# Altium schematic sheet Thermokoppel.SchDoc: Soldeerstation
size A4; SheetNumber: 4; SheetTotal: 5; SPICEModelCacheXJIMZCRK: <root> / <DocumentId>XJIMZCRK</DocumentId> / <CacheFrame Number="0"> / <Model Name="pnp" Kind="MDL"> / <Text>*Default PNP BJT / *PNP Trans Pinout: C,B,E / .MODEL PNP PNP()</Text> / </Model> / </CacheFrame> / </root>
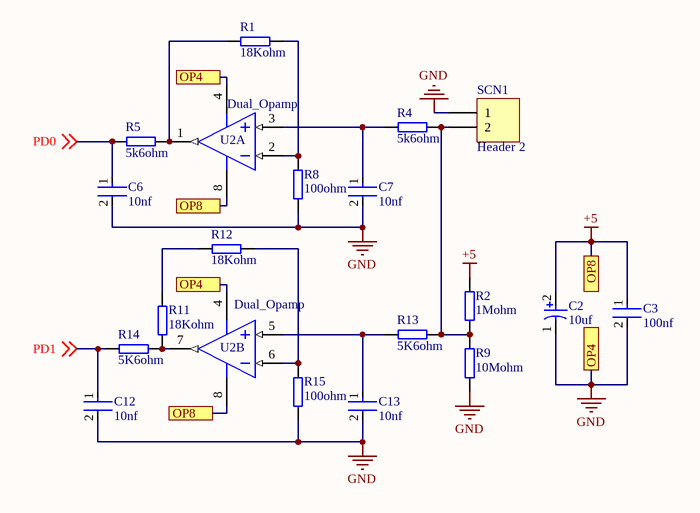
[diagram p0: Thermokoppel.SchDoc]

## Parts
C2  10uf  [CE_D4_L5,4]
C3  100nf  [CC_0805_m]
C6  10nf  [CC_0805_m]
C7  10nf  [CC_0805_m]
C12  10nf  [CC_0805_m]
C13  10nf  [CC_0805_m]
R1  18Kohm  [R_0805_M]
R2  1Mohm  [R_0805_M]
R4  5k6ohm  [R_0805_M]
R5  5k6ohm  [R_0805_M]
R8  100ohm  [R_0805_M]
R9  10Mohm  [R_0805_M]
R11  18Kohm  [R_0805_M]
R12  18Kohm  [R_0805_M]
R13  5K6ohm  [R_0805_M]
R14  5K6ohm  [R_0805_M]
R15  100ohm  [R_0805_M]
SCN1  Header 2  [Connector_2x1_p_5mm]
U2  Dual_Opamp  [MSOP_8_M]  (parts A,B of 2)

## Ports
OP4, OP8

## Nets
+5: C2.2 C3.1 R2.2 U2.8(VDD) ; port OP8
GND: C2.1 C3.2 C6.2 C7.2 C12.2 C13.2 R8.1 R9.1 R15.1 SCN1.1 U2.4(VSS) ; port OP4
PD0: C6.1 R5.1 ; off-sheet PD0
PD1: C12.1 R14.1 ; off-sheet PD1
NetC7_1: C7.1 R4.1 U2.3(VINA+)
NetC13_1: C13.1 R13.1 U2.5(VINB+)
NetR1_1: R1.1 R5.2 U2.1(VOUTA)
NetR1_2: R1.2 R8.2 U2.2(VINA-)
NetR2_1: R2.1 R4.2 R9.2 R13.2 SCN1.2
NetR11_1: R11.1 R14.2 U2.7(VOUTB)
NetR11_2: R11.2 R12.1
NetR12_2: R12.2 R15.2 U2.6(VINB-)

## Library data of the parts
C2 = Capacitor_Electrolytic: Manufacturer: Panasonic; Voltage Rating: 25 V; ComponentLink2URL: http://industrial.panasonic.com/cdbs/www-data/pdf/RDE0000/ABA0000C1181.pdf; Height: 10.2 mm; Max Operating Temperature: 105 degC; PackageReference: EEE-FK1E221P; ComponentLink1Description: Manufacturer URL; ComponentLink1URL: http://www.panasonic.com/; Mount: Surface Mount; REACH SVHC: No SVHC; Min Operating Temperature: -55 degC; ComponentLink2Description: Datasheet; DatasheetVersion: 03/2016; Length: 10.2 mm; RoHSCompliant: true; Packaging: Tape and Reel; Package Quantity: 500; Lead Pitch: 3.1 mm; Pins: 2; PackageDescription: 2-Pin Electrolytic Aluminum Capacitor, Body 8.3 x 8.3 mm; Mounting Technology: Surface Mount
C3 C6 C7 C12 C13 = Capacitor_Ceramic: Manufacturer: KEMET; Manufacturer Part Number: C0805C224K5RACTU; Value: 0.22 μF; Temperature Characteristic: X7R; Temperature Coefficient: 30ppm/°C; Tolerance: 0.1; Voltage Rating: 50 V; ComponentLink2URL: https://content.kemet.com/datasheets/KEM_C1003_C0G_SMD.pdf; Device Class L3: Ceramic Capacitors; Lead Free: Yes; Temperature: -55°C to +125°C; RoHS: TRUE; Capacitance: 0.22 μF; Automotive: No; Material: Ceramic; Octopart: https://octopart.com/c0805c224k5ractu-kemet-144670; Temperature Range Low: -55°C; Height: 0.88mm; Device Class L1: Passive Components; Digikey Description: CAP CER 0.22UF 50V X7R 0805; ComponentLink2Description: Datasheet; Mouser Description: CAP CER 0.22UF 50V X7R 0805; Category: Cap; Ipc Land Pattern Name: CAPC200125X78; Temperature Range High: +125°C; Package: C0805C-DN; Device Class L2: Capacitors
R1 R2 R4 R5 R8 R9 R11-R15 = Resistor: Manufacturer: Vishay Dale; Part Number: CRCW08050000Z0EA
SCN1 = Header 2: ScrewConnector, 2-Pin; LatestRevisionDate: 17-Jul-2002; LatestRevisionNote: Re-released for DXP Platform.; Publisher: Altium Limited
U2 = Dual_Opamp: Slew Rate: 0.6V/µs; Supply Current: 100uA; Power Supply Rejection Ratio (PSRR): 86dB; Input Offset Voltage (Vos): 4.5mV; Input Bias Current: 1pA; Amplifier Type: GENERAL PURPOSE; Unity Gain Bandwidth Product: 1MHz; Number of Circuits: 2; Output Current: 23mA; Operating Supply Voltage: 5.5V; Min Supply Voltage: 1.8V; Common Mode Rejection Ratio: 60dB; Voltage Gain: 112dB; Max Supply Voltage: 6V; Package Quantity: 60; REACH SVHC: No SVHC; Min Operating Temperature: -40°C; Max Operating Temperature: 125°C; Mount: Through Hole; Nominal Supply Current: 100uA; Height: 3.3mm; Length: 9.27mm; Slew Rate-Nom: 0.6V/µs; Packaging: Rail/Tube; Output Current per Channel: 23mA; Number of Amplifiers: 2; RoHS Compliant: Yes; Radiation Hardening: No; Bandwidth: 1MHz; Lead Free: Lead Free; Width: 6.35mm; Number of Channels: 2; Gain Bandwidth Product: 1MHz; Technology: CMOS; Operating Supply Current: 100uA; Number of Elements: 2; Number of Pins: 8; Input Offset Voltage-Max: 4.5mV; Case/Package: PDIP